# Altium schematic sheet NMT_XDATA_MUX.SCHDOC
size A4; Organization: Altium Limited; Address1: L3, 12a Rodborough Rd; Address2: Frenchs Forest; Address3: NSW; Address4: Australia 2086; DocumentNumber: 3; Revision: 0.94; SheetNumber: 11; SheetTotal: 13
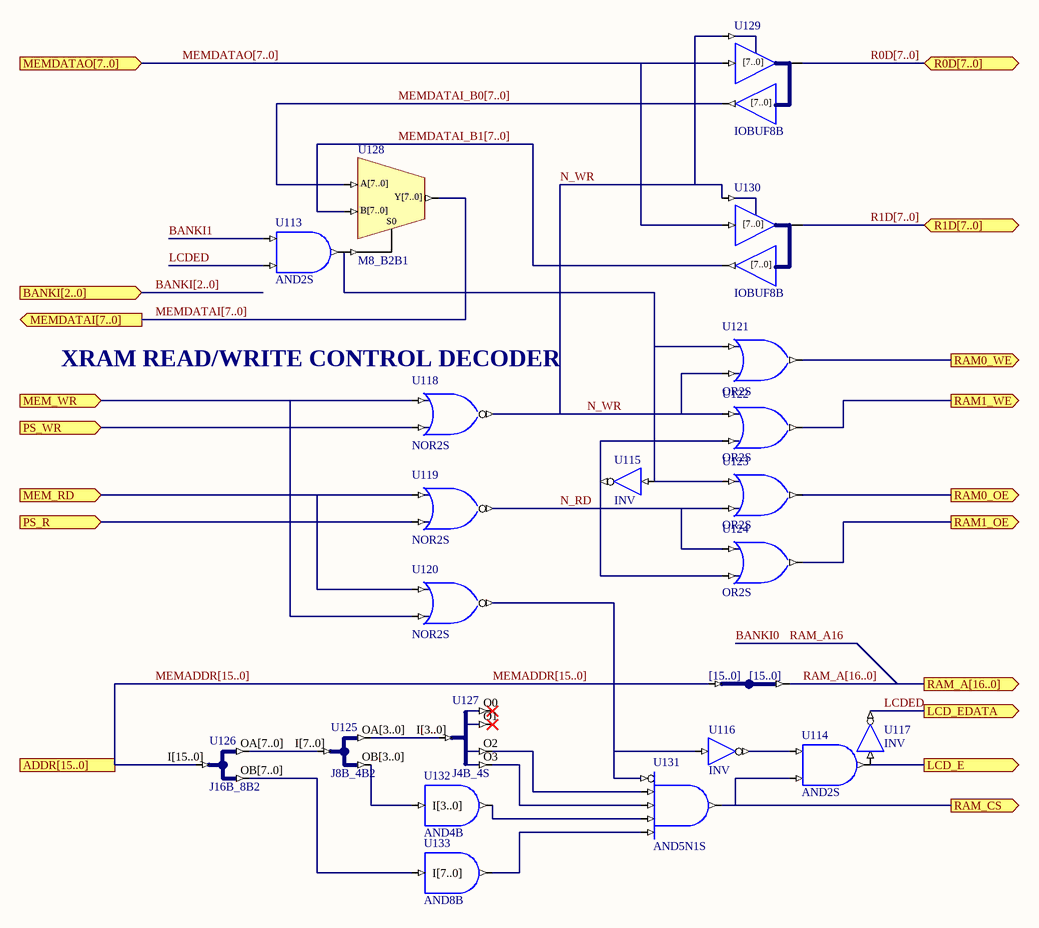
[diagram p0: NMT_XDATA_MUX.SCHDOC]

## Parts
JB_S4  IndexA: [15..0]  (hidden comment: JB)
U113  AND2S
U114  AND2S
U115  INV
U116  INV
U117  INV
U118  NOR2S
U119  NOR2S
U120  NOR2S
U121  OR2S
U122  OR2S
U123  OR2S
U124  OR2S
U125  J8B_4B2
U126  J16B_8B2
U127  J4B_4S
U128  M8_B2B1
U129  IOBUF8B
U130  IOBUF8B
U131  AND5N1S
U132  AND4B
U133  AND8B

## Ports
ADDR[15..0] (in), BANKI[2..0] (in), LCD_E (out), LCD_EDATA (out), MEM_RD (in), MEM_WR (in), MEMDATAI[7..0] (out), MEMDATAO[7..0] (in), PS_R (in), PS_WR (in), R0D[7..0] (bidir), R1D[7..0] (bidir), RAM0_OE (out), RAM0_WE (out), RAM1_OE (out), RAM1_WE (out), RAM_A[16..0] (out), RAM_CS (out)

## Nets
BANKI1: U113.I0
LCD_E: U114.O U117.I ; port LCD_E
LCDED: U113.I1 U117.O ; port LCD_EDATA
MEM_RD: U119.I0 U120.I0 ; port MEM_RD
MEM_WR: U118.I0 U120.I1 ; port MEM_WR
MEMADDR[15..0]: JB_S4.A[0..0](IA[0..0]) U126.I[15..0] ; port ADDR[15..0]
MEMDATAI[7..0]: U128.Y[7..0] ; port MEMDATAI[7..0]
MEMDATAI_B0[7..0]: U128.A[7..0] U129.O[7..0]
MEMDATAI_B1[7..0]: U128.B[7..0] U130.O[7..0]
MEMDATAO[7..0]: U129.I[7..0] U130.I[7..0] ; port MEMDATAO[7..0]
N_RD: U119.O U123.I1 U124.I0
N_WR: U118.O U121.I1 U122.I0 U129.T U130.T
PS_R: U119.I1 ; port PS_R
PS_WR: U118.I1 ; port PS_WR
R0D[7..0]: U129.IO[7..0] ; port R0D[7..0]
R1D[7..0]: U130.IO[7..0] ; port R1D[7..0]
RAM0_OE: U123.O ; port RAM0_OE
RAM0_WE: U121.O ; port RAM0_WE
RAM1_OE: U124.O ; port RAM1_OE
RAM1_WE: U122.O ; port RAM1_WE
RAM_A[16..0]: JB_S4.B[0..0] ; port RAM_A[16..0]
RAM_CS: U114.I1 U131.O ; port RAM_CS
NetU113_O: U113.O U115.I U121.I0 U123.I0 U128.S0
NetU114_I0: U114.I0 U116.O
NetU115_O: U115.O U122.I1 U124.I1
NetU116_I: U116.I U120.O U131.I0
NetU125_I[7..0]: U125.I[7..0] U126.OA[7..0]
NetU125_OA[3..0]: U125.OA[3..0] U127.I[3..0]
NetU125_OB[3..0]: U125.OB[3..0] U132.I[3..0]
NetU126_OB[7..0]: U126.OB[7..0] U133.I[7..0]
NetU127_O2: U127.O2 U131.I1
NetU127_O3: U127.O3 U131.I2
NetU131_I3: U131.I3 U132.O
NetU131_I4: U131.I4 U133.O

Not connected (* = marked no-connect by the designer): U127 O0* O1*

## Buses and harness runs
bus BANKI[2..0] = port BANKI[2..0]
bus MEMADDR[15..0] = port ADDR[15..0]
bus MEMDATAI[7..0] = port MEMDATAI[7..0]
bus MEMDATAI_B0[7..0]
bus MEMDATAI_B1[7..0]
bus MEMDATAO[7..0] = port MEMDATAO[7..0]
bus R0D[7..0] = port R0D[7..0]
bus R1D[7..0] = port R1D[7..0]
bus RAM_A[16..0] = port RAM_A[16..0]

## Notes on the sheet
- (near U118) XRAM READ/WRITE CONTROL DECODER
- Title
- Size:
- Date:
- A4
- Number:
- Time:
- Revision:
- Sheet
- of
- File:
- (in symbol IOBUF8B) [7..0]

## Library data of the parts
JB_S4 = JB: System Joiner; ArchiveName: GENERIC; Published: 7-Nov-2003; Publisher: Altium Limited; Core Revision: 1.00.00; IndexB: [15..0]
U113 = AND2S: 2-Input AND Gate, Single Pin Version; Xilinx Equivalent: AND2; ArchiveName: GENERIC; VHDLIB_SIM: GENERIC_LIB; Published: 29-Jan-2004; Publisher: Altium Limited; Core Revision: 1.00.00
U114 = AND2S: 2-Input AND Gate, Single Pin Version; Xilinx Equivalent: AND2; ArchiveName: GENERIC; Published: 7-Nov-2003; Publisher: Altium Limited; Core Revision: 1.00.00
U115-U117 = INV: Inverter; ArchiveName: GENERIC; Published: 7-Nov-2003; Publisher: Altium Limited; Xilinx Equivalent: INV; Core Revision: 1.00.00
U118-U120 = NOR2S: 2-Input NOR Gate, Single Pin Version; Xilinx Equivalent: NOR2; ArchiveName: GENERIC; Published: 7-Nov-2003; Publisher: Altium Limited; Core Revision: 1.00.00
U121-U124 = OR2S: 2-Input OR Gate, Single Pin Version; Xilinx Equivalent: OR2; ArchiveName: GENERIC; Published: 7-Nov-2003; Publisher: Altium Limited; Core Revision: 1.00.00
U125 = J8B_4B2: 1 x 8-bit input bus to 2 x 4-Bit output bus; ArchiveName: GENERIC; Published: 7-Nov-2003; Publisher: Altium Limited; Core Revision: 1.00.00
U126 = J16B_8B2: 1 x 16-bit input bus to 2 x 8-Bit output bus; ArchiveName: GENERIC; Published: 7-Nov-2003; Publisher: Altium Limited; Core Revision: 1.00.00
U127 = J4B_4S: 4-Bit input bus to 4 Single pin outputs; ArchiveName: GENERIC; Published: 7-Nov-2003; Publisher: Altium Limited; Core Revision: 1.00.00
U128 = M8_B2B1: 2x8-Bit Bus to 1x8-Bit Bus Multiplexer; ArchiveName: GENERIC; Published: 7-Nov-2003; Publisher: Altium Limited; Core Revision: 1.00.00
U129 U130 = IOBUF8B: 8-Bit Input/Output Buffer, Bus Version, Bus Version; ArchiveName: GENERIC; Published: 7-Nov-2003; Publisher: Altium Limited; Core Revision: 1.00.00
U131 = AND5N1S: 5-Input AND Gate with Active Low A Input, Single Pin Version; Xilinx Equivalent: AND5B1; ArchiveName: GENERIC; Published: 7-Nov-2003; Publisher: Altium Limited; Core Revision: 1.00.00
U132 = AND4B: 4-Input AND Gate, Bus Version; ArchiveName: GENERIC; Published: 7-Nov-2003; Publisher: Altium Limited; Core Revision: 1.00.00
U133 = AND8B: 8-Input AND Gate, Bus Version; ArchiveName: GENERIC; Published: 7-Nov-2003; Publisher: Altium Limited; Core Revision: 1.00.00